# EAGLE design multi_controller_1_37 (EAGLE 9.6.2)
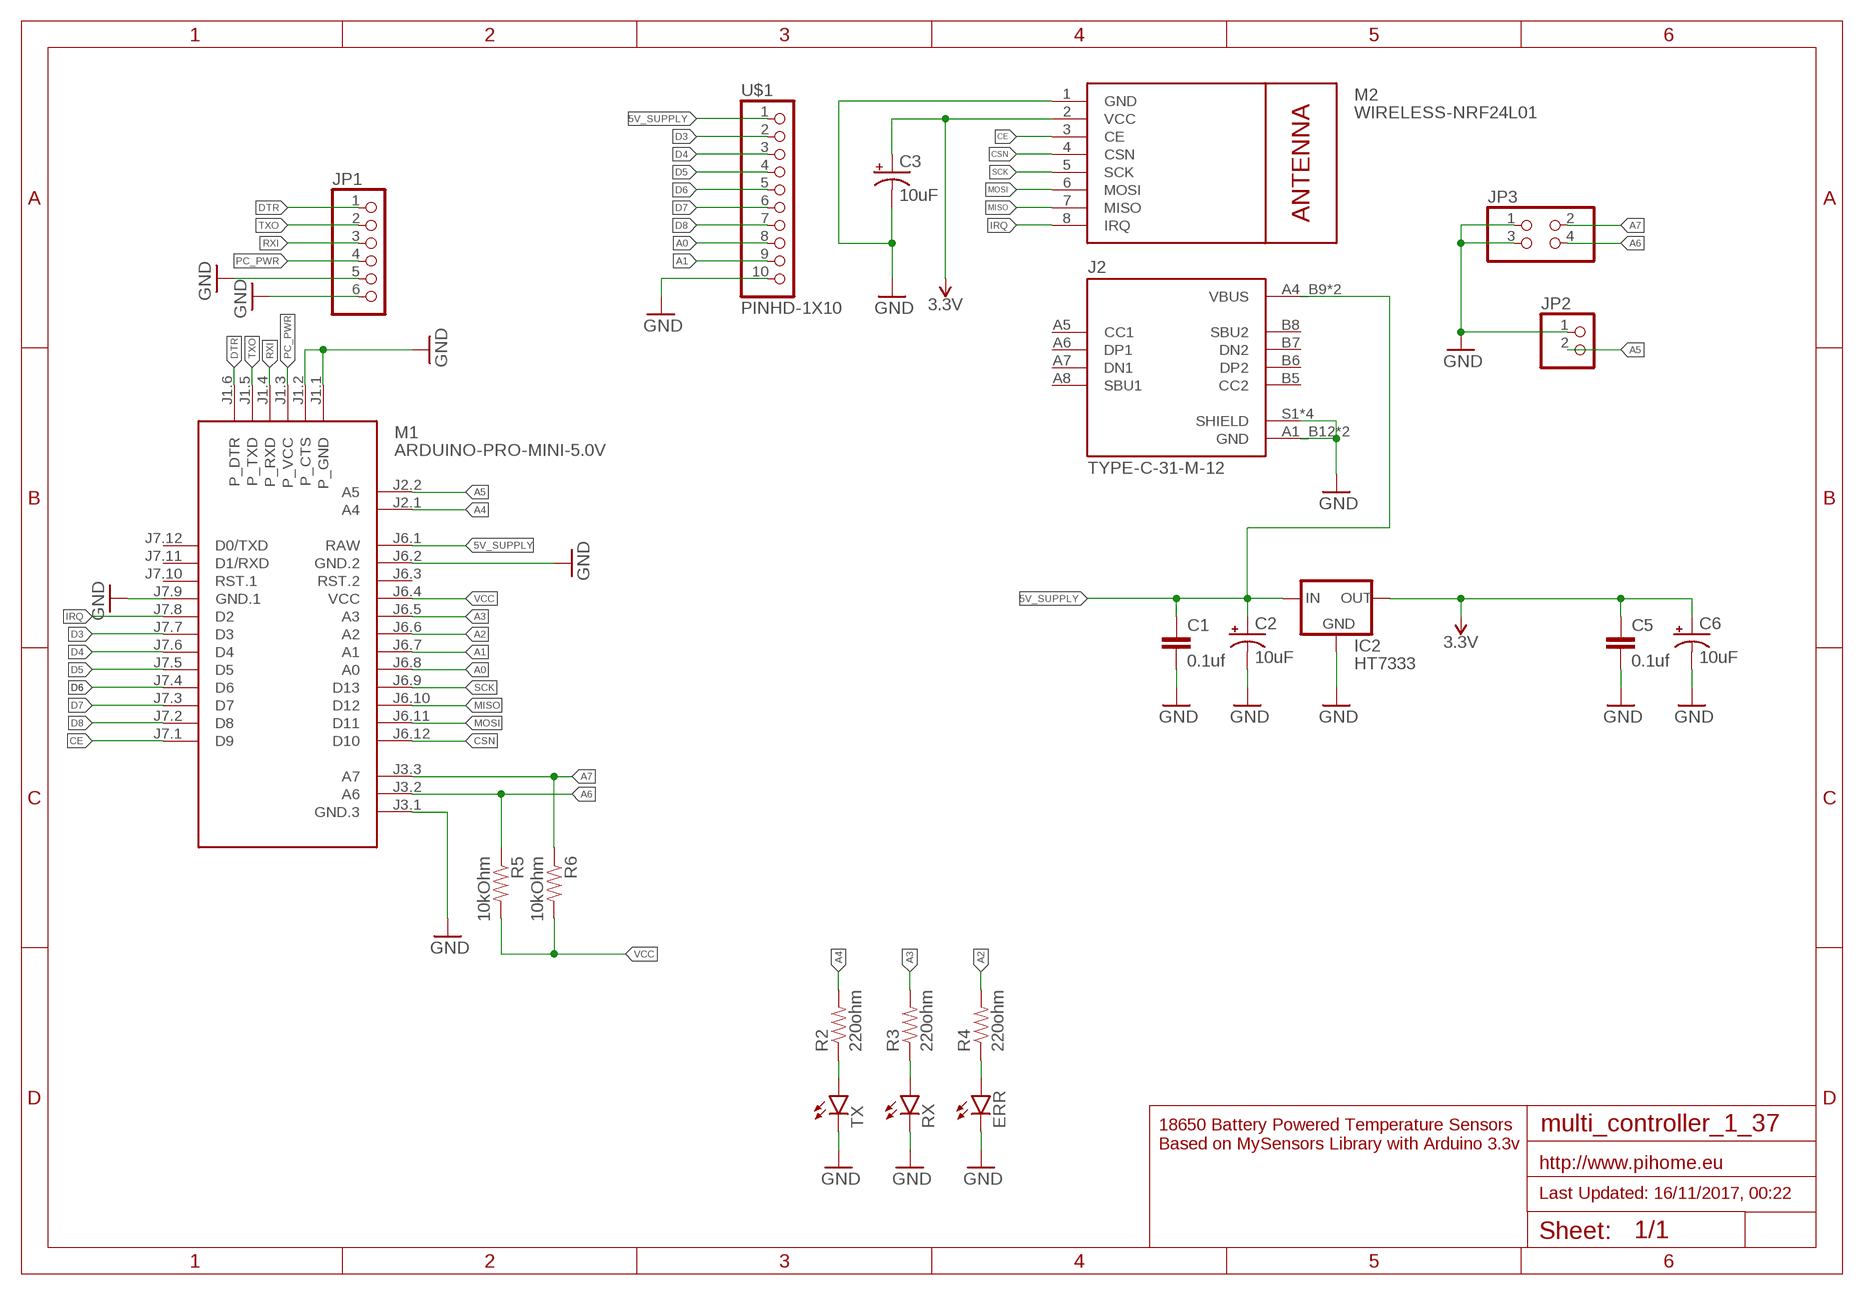
[diagram p0: schematic, sheet 1]

## Parts
C1  0.1uf  0.1UF-50V-20%(PTH)KIT-EZ  [CAP-PTH-SMALL-KIT]
C2  10uF  10UF-25V-20%(PTH)KIT  [CPOL-RADIAL-10UF-25V-KIT]
C3  10uF  10UF-25V-20%(PTH)KIT  [CPOL-RADIAL-10UF-25V-KIT]
C5  0.1uf  0.1UF-50V-20%(PTH)KIT-EZ  [CAP-PTH-SMALL-KIT]
C6  10uF  10UF-25V-20%(PTH)KIT  [CPOL-RADIAL-10UF-25V-KIT]
ERR  LED3MM  [LED3MM]
IC2  HT7333  [SOT-89]
J2  TYPE-C-31-M-12  [HRO_TYPE-C-31-M-12]
JP1  PINHD-1X6  [1X06]
JP2  PINHD-1X2  [1X02]
JP3  PINHD-2X2  [2X02]
M1  ARDUINO-PRO-MINI-5.0V  [ARDUINO-PRO-MINI]
M2  WIRELESS-NRF24L01  [WIRELESS-NRF24L01]
R2  220ohm  RESISTORAXIAL-0.3  [AXIAL-0.3]
R3  220ohm  RESISTORAXIAL-0.3  [AXIAL-0.3]
R4  220ohm  RESISTORAXIAL-0.3  [AXIAL-0.3]
R5  10kOhm  RESISTORAXIAL-0.3  [AXIAL-0.3]
R6  10kOhm  RESISTORAXIAL-0.3  [AXIAL-0.3]
RX  LED3MM  [LED3MM]
TX  LED3MM  [LED3MM]
U$1  PINHD-1X10  [1X10-BIG]

## Nets
3.3V: C3.1(+) C5.1 C6.1(+) IC2.1(OUT) M2.2(VCC)
5V_SUPPLY: C1.1 C2.1(+) IC2.3(IN) IC2.4(IN) J2.A4_B9(VBUS) J2.B4_A9(VBUS) M1.J6.1(RAW) U$1.1
A0: M1.J6.8(A0) U$1.8
A1: M1.J6.7(A1) U$1.9
A2: M1.J6.6(A2) R4.P$2
A3: M1.J6.5(A3) R3.P$2
A4: M1.J2.1(A4) R2.P$2
A5: JP2.2 M1.J2.2(A5)
A6: JP3.4 M1.J3.2(A6) R5.P$1
A7: JP3.2 M1.J3.3(A7) R6.P$1
CE: M1.J7.1(D9) M2.3(CE)
CSN: M1.J6.12(D10) M2.4(CSN)
D3: M1.J7.7(D3) U$1.2
D4: M1.J7.6(D4) U$1.3
D5: M1.J7.5(D5) U$1.4
D6: M1.J7.4(D6) U$1.5
D7: M1.J7.3(D7) U$1.6
D8: M1.J7.2(D8) U$1.7
DTR: JP1.1 M1.J1.6(P_DTR)
GND: C1.2 C2.2(-) C3.2(-) C5.2 C6.2(-) ERR.K(C) IC2.2(GND) J2.A1_B12(GND) J2.B1_A12(GND) J2.S1(SHIELD) J2.S2(SHIELD) J2.S3(SHIELD) J2.S4(SHIELD) JP1.5 JP1.6 JP2.1 JP3.1 JP3.3 M1.J1.1(P_GND) M1.J1.2(P_CTS) M1.J6.2(GND.2) M1.J7.9(GND.1) M2.1(GND) RX.K(C) TX.K(C) U$1.10
IRQ: M1.J7.8(D2) M2.8(IRQ)
MISO: M1.J6.10(D12) M2.7(MISO)
MOSI: M1.J6.11(D11) M2.6(MOSI)
N$1: M1.J3.1(GND.3) ; supply symbol labelled GND
N$2: R2.P$1 TX.A
N$6: R3.P$1 RX.A
N$7: ERR.A R4.P$1
PC_PWR: JP1.4 M1.J1.3(P_VCC)
RXI: JP1.3 M1.J1.4(P_RXD)
SCK: M1.J6.9(D13) M2.5(SCK)
TXO: JP1.2 M1.J1.5(P_TXD)
VCC: M1.J6.4(VCC) R5.P$2 R6.P$2
Unconnected: J2.A5(CC1) J2.A6(DP1) J2.A7(DN1) J2.A8(SBU1) J2.B5(CC2) J2.B6(DP2) J2.B7(DN2) J2.B8(SBU2) M1.J6.3(RST.2) M1.J7.10(RST.1) M1.J7.11(D1/RXD) M1.J7.12(D0/TXD)

## Notes on the sheet
- 18650 Battery Powered Temperature Sensors
  Based on MySensors Library with Arduino 3.3v
- http://www.pihome.eu
- Last Updated: 16/11/2017, 00:22

## Library data of the parts
C1 C5 = SparkFun-Capacitors:0.1UF-50V-20%(PTH): CAP-08370; PROD_ID: CAP-08370
C2 C3 C6 = SparkFun-Capacitors:10UF-25V-20%(PTH): CAP-08440; PROD_ID: CAP-08440
ERR RX TX = SparkFun-LED:LED: LEDs Standard schematic elements and footprints for 5mm, 3mm, 1206, and 0603 sized LEDs. 5mm - Spark Fun Electronics SKU : COM-00529 (and others); PROD_ID: DIO-08794
IC2 = holtek2:HT73*
J2 = TYPE-C-31-M-12:TYPE-C-31-M-12: Check availability <https://pricing.snapeda.com/parts/TYPE-C-31-M-12/HRO%20Electronics%20Co.%2C%20Ltd./view-part?ref=eda>; AVAILABILITY: Not in stock; CHECK_PRICES: https://www.snapeda.com/parts/TYPE-C-31-M-12/HRO+Electronics+Co.%252C+Ltd./view-part/?ref=eda; DESCRIPTION: USB Connectors 24 Receptacle 1 8.94*7.3mm RoHS; MF: HRO Electronics Co., Ltd.; MP: TYPE-C-31-M-12; PACKAGE: Package; PRICE: None; SNAPEDA_LINK: https://www.snapeda.com/parts/TYPE-C-31-M-12/HRO+Electronics+Co.%252C+Ltd./view-part/?ref=snap
JP1 = adafruit:PINHD-1X6: PIN HEADER
JP2 = pinhead:PINHD-1X2: PIN HEADER
JP3 = pinhead:PINHD-2X2: PIN HEADER
M1 = diy-modules:ARDUINO-PRO-MINI-*: Arduino Pro Mini
M2 = diy-modules:WIRELESS-NRF24L01: 2.4 GHz Wireless Module based on NRF24L01 chip
R2-R4 = SparkFun-Passives:RESISTOR: Resistor Basic schematic elements and footprints for 0603, 1206, and PTH resistors.
R5 R6 = SparkFun-Resistors:RESISTOR: Resistor Basic schematic elements and footprints for 0603, 1206, and PTH resistors.
U$1 = adafruit:PINHD-1X10: Pin header 1x10 0.1" spacing With round pins

## Net classes
0 default: width 0.305 mm, drill 0.508 mm, clearance 0.254 mm

## Board
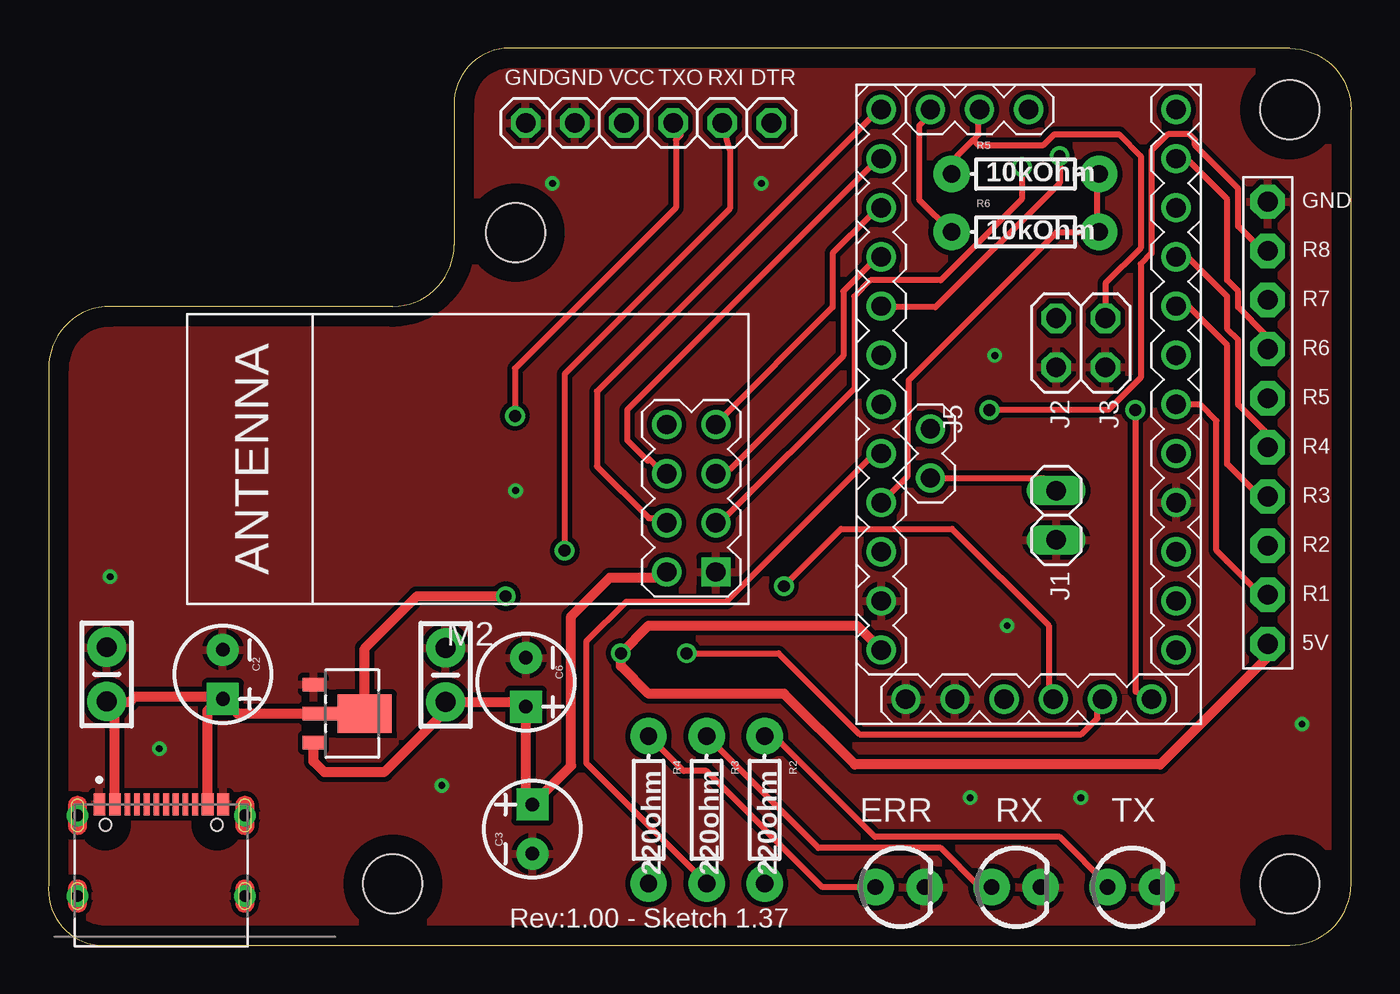
[diagram p1: board, top side]
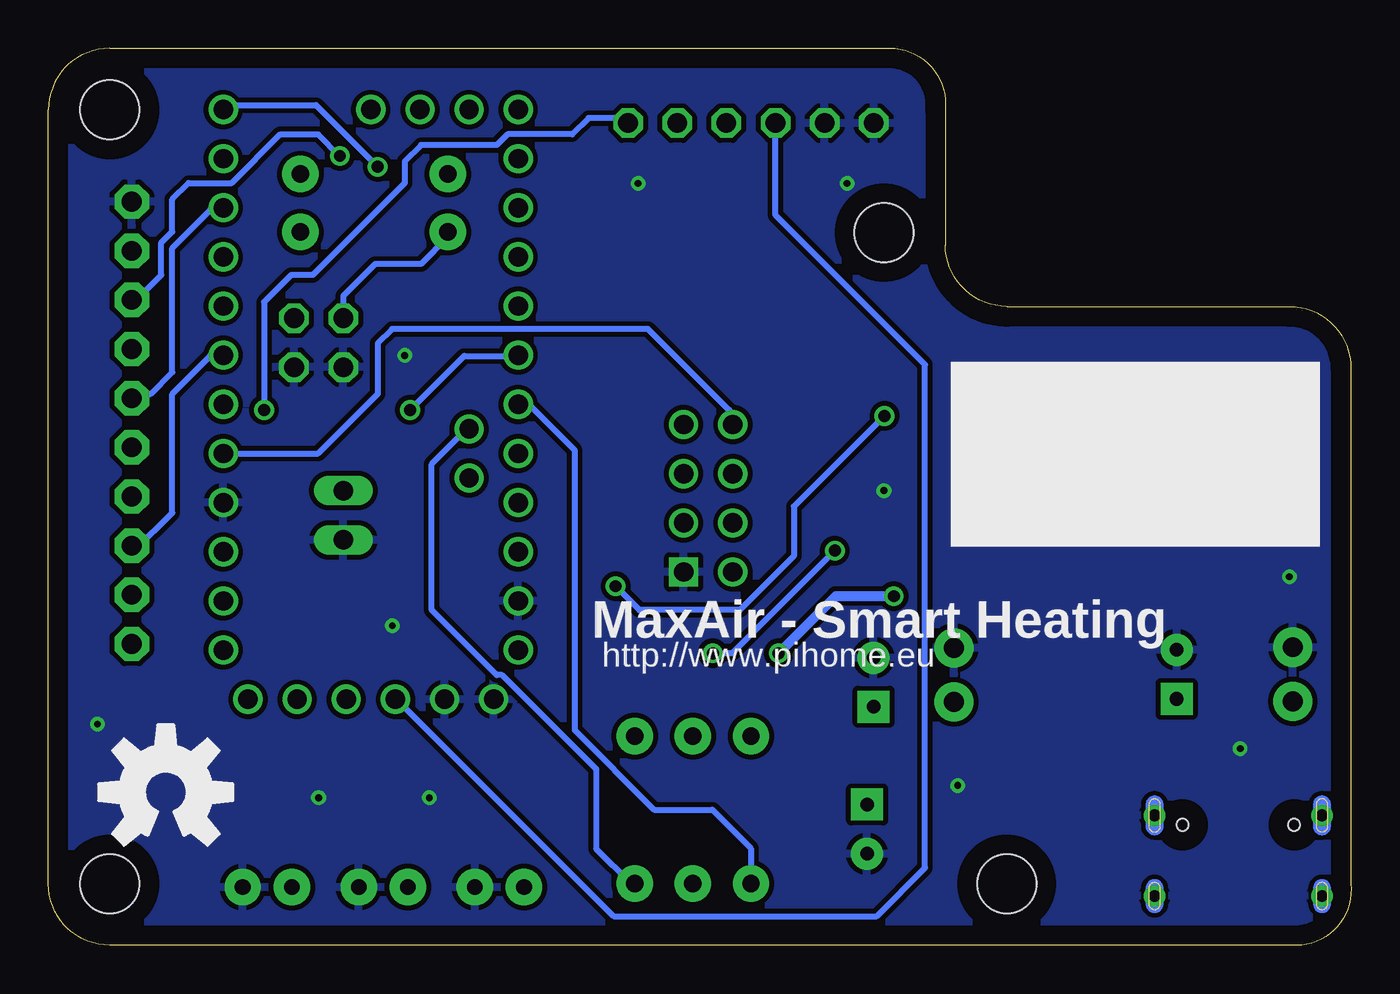
[diagram p2: board, bottom side, seen from below]

Size 67.33 x 46.35 mm. Coordinates in mm from the lower left corner, seen from the top.
Outline: 2.56,0 64.15,0 arc90 67.33,3.17 67.33,43.18 arc90 64.15,46.35 23.56,46.35 arc90 20.97,43.18 20.97,36.2 arc-90 17.8,33.02 3.19,33.02 arc90 0.02,29.84 0.02,3.17 arc90 2.56,0
Copper layers (1*16): Top 0.035mm / dielectric 1.5mm / Bottom 0.035mm
Design rules "default": minimum track width 10mil, minimum drill 24mil, track to track 8mil, track to pad 8mil, pad to pad 8mil, via to via 8mil, smd to smd 8mil, copper to edge 40mil, drill to drill 8mil, minimum pad ring 10mil, minimum via ring 8mil, stop-mask expansion 4mil, vias tented up to drill 0mil, thermal gap 10mil
Holes 3.05 mm at 17.8,3.17 64.15,3.17 64.15,43.18 24.15,36.83

### Footprints (pad centres in the part's own frame; a part is rotated, then mirrored left to right if it is on the bottom)
CAP-PTH-SMALL-KIT = drill 1.016 pad 2.032: 1 -1.397,0; 2 1.397,0
CPOL-RADIAL-10UF-25V-KIT = drill 0.7 pad 1.651 square: 1 1.27,0 | drill 0.7 pad 1.651: 2 -1.27,0
LED3MM = drill 0.813 pad 1.88: A -1.27,0; K 1.27,0
SOT-89 = smd 0.7 x 1.1: 1 1.5,-2.385; 2 -1.5,-2.385 | smd 0.7 x 1.8: 3 0,-2.035 | smd 2 x 2.8: 4 0,0.265
HRO_TYPE-C-31-M-12 = smd 0.6 x 1.14: A1_B12 -3.2,4.75; A4_B9 -2.4,4.75; B1_A12 3.2,4.75; B4_A9 2.4,4.75 | smd 0.3 x 1.14: A5 -1.25,4.75; A6 -0.25,4.75; A7 0.25,4.75; A8 1.25,4.75; B5 1.75,4.75; B6 0.75,4.75; B7 -0.75,4.75; B8 -1.75,4.75 | drill 0.6 pad 0.9: S1 -4.325,4.17; S2 4.325,4.17; S3 -4.325,0; S4 4.325,0 | hole 0.6: -2.89,3.68; 2.89,3.68
1X06 = drill 1.016 octagon: 1 -6.35,0; 2 -3.81,0; 3 -1.27,0; 4 1.27,0; 5 3.81,0; 6 6.35,0
1X02 = drill 1.016 long: 1 -1.27,0; 2 1.27,0
2X02 = drill 1.016 octagon: 1 -1.27,-1.27; 2 -1.27,1.27; 3 1.27,-1.27; 4 1.27,1.27
ARDUINO-PRO-MINI = drill 1: J1.1 -15.24,6.35; J1.2 -15.24,3.81; J1.3 -15.24,1.27; J1.4 -15.24,-1.27; J1.5 -15.24,-3.81; J1.6 -15.24,-6.35; J2.1 -1.27,5.08; J2.2 -3.81,5.08; J3.1 15.24,0; J3.2 15.24,2.54; J3.3 15.24,5.08; J6.1 -12.7,7.62; J6.2 -10.16,7.62; J6.3 -7.62,7.62; J6.4 -5.08,7.62; J6.5 -2.54,7.62; J6.6 0,7.62; J6.7 2.54,7.62; J6.8 5.08,7.62; J6.9 7.62,7.62; J6.10 10.16,7.62; J6.11 12.7,7.62; J6.12 15.24,7.62; J7.1 15.24,-7.62; J7.2 12.7,-7.62; J7.3 10.16,-7.62; J7.4 7.62,-7.62; J7.5 5.08,-7.62; J7.6 2.54,-7.62; J7.7 0,-7.62; J7.8 -2.54,-7.62; J7.9 -5.08,-7.62; J7.10 -7.62,-7.62; J7.11 -10.16,-7.62; J7.12 -12.7,-7.62
WIRELESS-NRF24L01 = drill 1 square: 1 -12.7,6.35 | drill 1: 2 -10.16,6.35; 3 -12.7,3.81; 4 -10.16,3.81; 5 -12.7,1.27; 6 -10.16,1.27; 7 -12.7,-1.27; 8 -10.16,-1.27
AXIAL-0.3 = drill 0.9 pad 1.88: P$1 -3.81,0; P$2 3.81,0
1X10-BIG = drill 1.016 pad 1.778 octagon: 1 -11.43,0; 2 -8.89,0; 3 -6.35,0; 4 -3.81,0; 5 -1.27,0; 6 1.27,0; 7 3.81,0; 8 6.35,0; 9 8.89,0; 10 11.43,0

### Placement (x,y rotation side)
C1  3.02,14 90 top
C2  9.02,14 270 top
C3  25.02,6 90 top
C5  20.53,13.97 90 top
C6  24.68,13.59 270 top
ERR  44.02,3 0 top
IC2  16.08,11.97 270 top
J2  5.83,2.54 0 top
JP1  31.02,42.5 180 top
JP2  52.09,22.23 90 top
JP3  53.36,31.14 0 top
LOGO1  OSHW-LOGOL  [OSHW-LOGO-L]  61.26,7.91 0 bottom
M1  50.66,27.96 90 top
M2  21.8,25.64 180 top
R2  37.02,7 270 top
R3  34.02,7 270 top
R4  31.02,7 270 top
R5  50.5,39.86 0 top
R6  50.5,36.86 0 top
RX  50.02,3 0 top
TX  56.02,3 0 top
U$1  63.02,27 90 top

### Tracks (layer width: path | path; a pad name or v marks a point on that pad's centre or on a via)
3.3V
  Top 0.305: 13.71,10.34 IC2.1
  Top 0.406: 20.41,12.57 C5.1 | C3.1 24.68,7.61
  Top 0.508: 13.71,10.34 13.71,9.5 14.27,8.94 17.34,8.94 20.41,12.01 20.41,12.57 | C5.1 24.43,12.57 C6.1 24.68,7.61 | C3.1 27.02,9.27 27.02,17 29.02,19 31.67,19 M2.2
5V_SUPPLY  (via drill 0.61)
  Top 0.305: IC2.3 14.27,12.01 16.22,12.01 IC2.4 16.5,12.01 | 8.96,12.85 C2.1 | 3.09,12.57 C1.1
  Top 0.508: IC2.4 16.35,15.33 19.06,18.04 v23.63,18.04 | J2.A4_B9 3.43,12.23 3.09,12.57 4.21,12.57 4.49,12.85 8.96,12.85 8.23,12.13 J2.B4_A9 | IC2.3 9.78,11.97 C2.1 | U$1.1 63.02,14.9 57.46,9.34 41.68,9.34 38.02,13 31.02,13 29.59,14.43 v29.59,15.09 31.02,16.52 41.78,16.52 M1.J6.1
  Bottom 0.508: v29.59,15.09 26.63,18.04 v23.63,18.04
A0  (via drill 0.61)
  Top 0.305: 43.05,32.97 45.84,32.97 52.27,39.4 v52.27,40.79 | 43.05,32.97 M1.J6.8 | 43.05,32.97 M1.J6.8
  Bottom 0.305: v52.27,40.79 53.38,41.91 55.34,41.91 57.85,39.4 60.09,39.4 60.93,38.56 60.93,36.88 61.49,36.32 61.49,34.65 62.88,33.25 U$1.8
A1  (via drill 0.61)
  Top 0.305: v48.63,27.66 54.78,27.66 56.46,29.34 56.46,35.2 57.02,35.76 57.02,41.07 57.85,41.91 58.97,41.91 59.25,41.63 59.25,41.35 61.49,39.12 61.49,37.16 62.88,35.76 U$1.9
  Bottom 0.305: 43.05,30.45 45.84,30.45 v48.63,27.66 | 43.05,30.45 M1.J6.7 | 43.05,30.45 M1.J6.7
A2
  Bottom 0.305: M1.J6.6 43.05,27.94 M1.J6.6 42.77,27.94 42.49,27.94 40.13,25.59 40.13,11.12 36.02,7 33.02,7 31.02,5 31.02,4 31.03,3.91 31.03,3.35 R4.P$2
A3
  Top 0.305: M1.J6.5 42.77,25.15 42.44,25.15 35.05,17.77 29.87,17.77 27.8,15.69 27.8,9.41 R3.P$2
A4
  Bottom 0.305: M1.J2.1 45.56,26.82 M1.J2.1 45.84,26.54 47.52,24.87 47.52,17.32 44.16,13.97 43.88,13.97 39.02,9.1 39.02,4.99 37.22,3.19 R2.P$2
A5
  Top 0.305: M1.J2.2 51.44,24.15 JP2.2
A6
  Top 0.305: 47.79,41.63 46.96,40.79 46.96,39.95 R5.P$1 | 47.79,41.63 48.07,41.91 48.07,43.03 M1.J3.2 48.07,43.31 M1.J3.2 | 47.79,41.63 48.07,41.35 51.43,41.35 51.99,41.91 55.34,41.91 56.46,40.79 56.46,36.04 54.63,34.21 JP3.4
A7
  Top 0.305: R6.P$1 45,38.55 45,42.35 45.56,42.91 45.56,43.03 M1.J3.3 45.56,43.31 M1.J3.3
  Bottom 0.305: R6.P$1 46.69,36.59 48.07,35.2 50.44,35.2 52.09,33.55 JP3.2
CE  (via drill 0.61)
  Top 0.305: v50.31,40.23 50.31,38.56 46.12,34.37 42.49,34.37 41.65,33.53 41.65,28.78 34.94,22.07 34.66,22.07 M2.3
  Bottom 0.305: v50.31,40.23 53.5,43.42 58.02,43.42 58.13,43.31 | 58.13,43.31 M1.J7.1 | 58.13,43.31 M1.J7.1
CSN
  Top 0.305: M2.4 31.87,22.07 31.03,22.07 28.35,24.75 28.35,28.62 42.49,42.75 42.49,43.03 42.77,43.31 43.01,43.22 | 43.01,43.22 M1.J6.12 | M1.J6.12 43.05,43.31 43.01,43.22
D3
  Top 0.305: 58.41,27.94 59.53,27.94 60.37,27.1 60.37,20.4 62.88,17.88 U$1.2 | 58.41,27.94 M1.J7.7 | 58.41,27.94 M1.J7.7
D4
  Bottom 0.305: 58.41,30.45 58.97,30.45 60.93,28.5 60.93,22.35 62.88,20.4 U$1.3 | 58.41,30.45 M1.J7.6 | 58.41,30.45 M1.J7.6
D5
  Top 0.305: 58.41,32.97 58.97,32.97 60.93,31.01 60.93,24.87 62.88,22.91 U$1.4 | 58.41,32.97 M1.J7.5 | 58.41,32.97 M1.J7.5
D6
  Top 0.305: 58.41,35.48 58.97,35.48 60.93,33.53 60.93,31.85 61.49,31.29 61.49,27.94 62.88,26.54 62.88,25.98 U$1.5 | 58.41,35.48 M1.J7.4 | 58.41,35.48 M1.J7.4
D7
  Bottom 0.305: 58.41,38 58.97,38 60.93,36.04 60.93,29.62 62.04,28.5 62.88,28.5 U$1.6 | 58.41,38 M1.J7.3 | 58.41,38 M1.J7.3
D8
  Top 0.305: 58.41,40.51 58.97,40.51 60.93,38.56 60.93,34.37 61.49,33.81 61.49,32.97 62.88,31.57 62.88,31.01 U$1.7 | 58.41,40.51 M1.J7.2 | 58.41,40.51 M1.J7.2
DTR  (via drill 0.61)
  Top 0.305: v56.18,27.66 56.18,13.11 56.97,12.75 | 56.97,12.75 M1.J1.6 | M1.J1.6 57.02,12.85 56.97,12.75
  Bottom 0.305: v56.18,27.66 56.18,33.25 54.78,34.65 53.66,34.65 48.91,39.4 48.91,40.51 48.07,41.35 44.16,41.35 43.6,41.91 40.25,41.91 39.41,42.75 37.85,42.75 JP1.1
GND  (via drill 0.35)
  other vias: 49.55,16.51 3.19,19.05 36.85,39.37 48.91,30.48 47.64,7.62 53.36,7.62 64.79,11.43 20.34,8.26 5.73,10.16 24.15,23.5 26.05,39.37
  pour Top: 0.02,0 0.02,33.02 20.97,33.02 20.97,46.35 67.33,46.35 67.33,0
  pour Bottom: 0.02,0 0.02,33.02 20.97,33.02 20.97,46.35 67.33,46.35 67.33,0
IRQ
  Bottom 0.305: M2.8 32.15,27.1 32.15,27.66 36.34,31.85 49.57,31.85 50.31,31.11 50.31,28.5 53.38,25.43 58.13,25.43 M1.J7.8
MISO
  Top 0.305: M2.7 34.66,27.1 40.53,32.97 40.53,35.76 42.49,37.72 42.49,38 42.77,38.28 M1.J6.10 43.05,38 M1.J6.10
MOSI
  Top 0.305: 42.77,40.79 42.49,40.51 42.49,40.23 29.91,27.66 29.91,26.1 30.95,25.07 | 42.77,40.79 M1.J6.11 | 30.95,25.07 30.98,25.04 | M2.6 31.87,24.59 31.59,24.59 31.03,25.15 30.95,25.07 | 42.77,40.79 M1.J6.11
N$2
  Top 0.305: R2.P$1 37.5,10.81 42.72,5.59 52.27,5.59 54.78,3.07 TX.A
N$6
  Top 0.305: RX.A 48.63,3.07 48.07,3.07 46.12,5.03 39.8,5.03 R3.P$1
N$7
  Top 0.305: ERR.A 40.02,3 34.02,9 32.83,9 R4.P$1
PC_PWR
  Bottom 0.305: M1.J1.3 49.47,12.85 M1.J1.3 49.19,12.57 38.12,1.5 24.52,1.5 22.02,4 22.02,30 29.75,37.73 JP1.4
RXI  (via drill 0.61)
  Top 0.305: v38.02,18.56 40.97,21.51 46.71,21.51 51.71,16.52 51.71,12.85 51.92,12.73 | v24.12,27.35 24.12,29.81 32.43,38.12 32.43,41.63 32.69,41.89 32.66,41.99 JP1.3 | 51.92,12.73 M1.J1.4 | M1.J1.4 51.99,12.85 51.92,12.73
  Bottom 0.305: v38.02,18.56 36.78,17.32 31.59,17.32 28.8,20.12 28.8,22.68 v24.12,27.35
SCK
  Top 0.305: M2.5 34.66,24.59 35.22,24.59 41.09,30.45 41.09,33.81 42.49,35.2 42.49,35.48 42.77,35.76 M1.J6.9 43.05,35.48 M1.J6.9
TXO  (via drill 0.61)
  Top 0.305: v32.99,15.09 37.74,15.09 41.93,10.9 53.38,10.9 54.22,11.73 54.22,12.57 M1.J1.5 54.5,12.85 M1.J1.5 | v26.68,20.4 26.68,29.53 35.22,38.07 35.22,41.17 35.2,41.16 JP1.2
  Bottom 0.305: v26.68,20.4 31.99,15.09 v32.99,15.09
VCC
  Top 0.305: M1.J6.4 44.42,24.26 44.42,27.17 44.47,27.21 44.47,29.21 52.12,36.86 R6.P$2 54.22,36.88 54.22,39.67 R5.P$2

### Text on the board
tPlace: GND | GND | VCC | TXO | RXI | DTR | GND | R8 | R7 | R6 | J5 | J2 | J3 | R5 | R4 | R3 | R2 | J1 | R1 | 5V | Rev:1.00 - Sketch 1.37
bPlace: http://www.pihome.eu
bNames: MaxAir - Smart Heating